# Altium project CryptUS_Motherboard_Rev1_A.PrjPcb
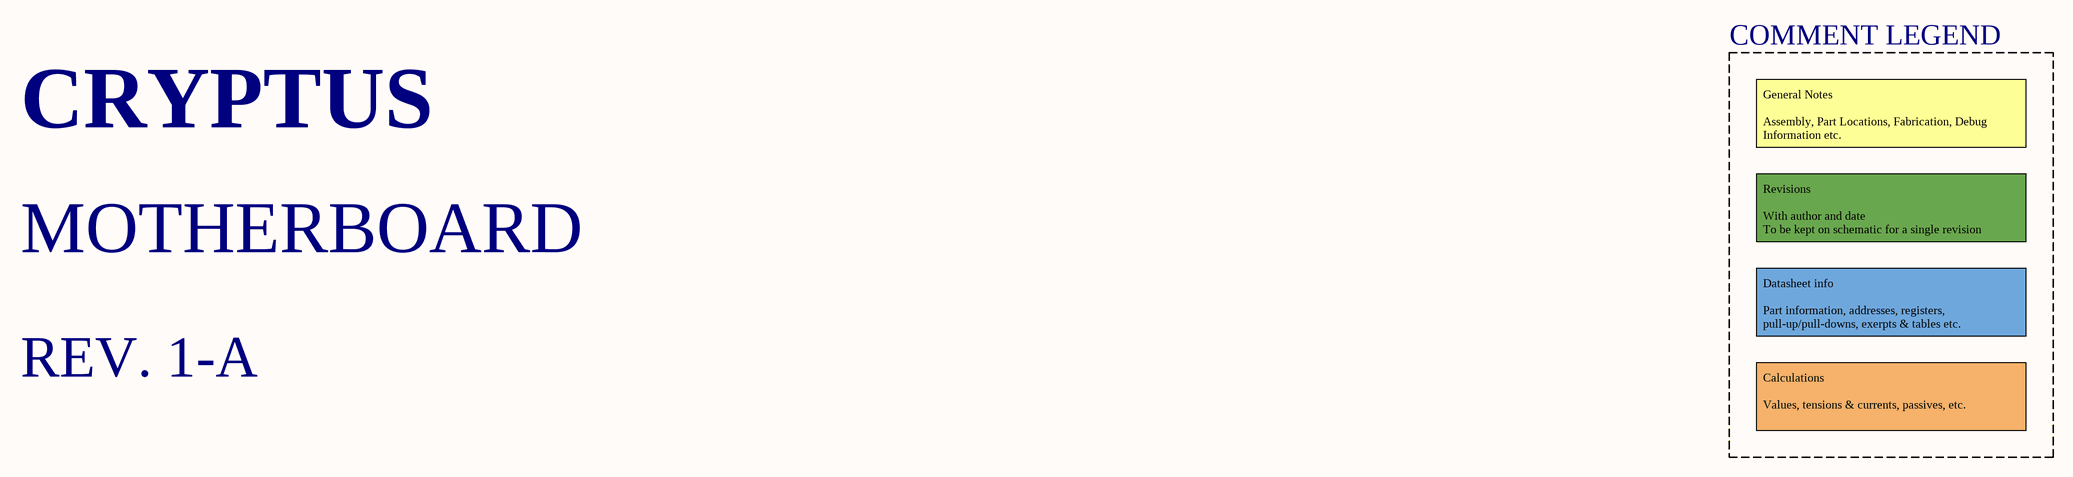
[diagram p0: Title.SchDoc]
Project: CryptUS_Motherboard
6 sheets, 42 parts. Net scope: global (net labels, ports and power ports of the same name join across sheets).
Board file: Motherboard_Rev1_A.PcbDoc
Sheets:
  Title.SchDoc
  Mechanical and Interconnect.SchDoc
  Power.SchDoc
  IO Extender.SchDoc
  Telemetry.SchDoc
  Debug.SchDoc

## Sheet Title.SchDoc
size 420 x 297 mm; SheetNumber: 1; SheetTotal: 3

### Notes on the sheet
- COMMENT LEGEND
- CRYPTUS
- General Notes
  Assembly, Part Locations, Fabrication, Debug Information etc.
- MOTHERBOARD
- Revisions
  With author and date
  To be kept on schematic for a single revision
- Datasheet info
  Part information, addresses, registers, pull-up/pull-downs, exerpts & tables etc.
- REV. 1-A
- Calculations
  Values, tensions & currents, passives, etc.
- PROJECT
- TITLE
- FILE NAME
- A3
- SIZE
- DWG NO.
- SHEET
- OF
- REV

## Sheet Mechanical and Interconnect.SchDoc: Mechanical and Interconnect
size 420 x 297 mm; Address1: CryptUS; Address3: Pascal-Emmanuel Lachance; Address4: Benjamin Gélinas; Revision: A; SheetNumber: 2; SheetTotal: 7
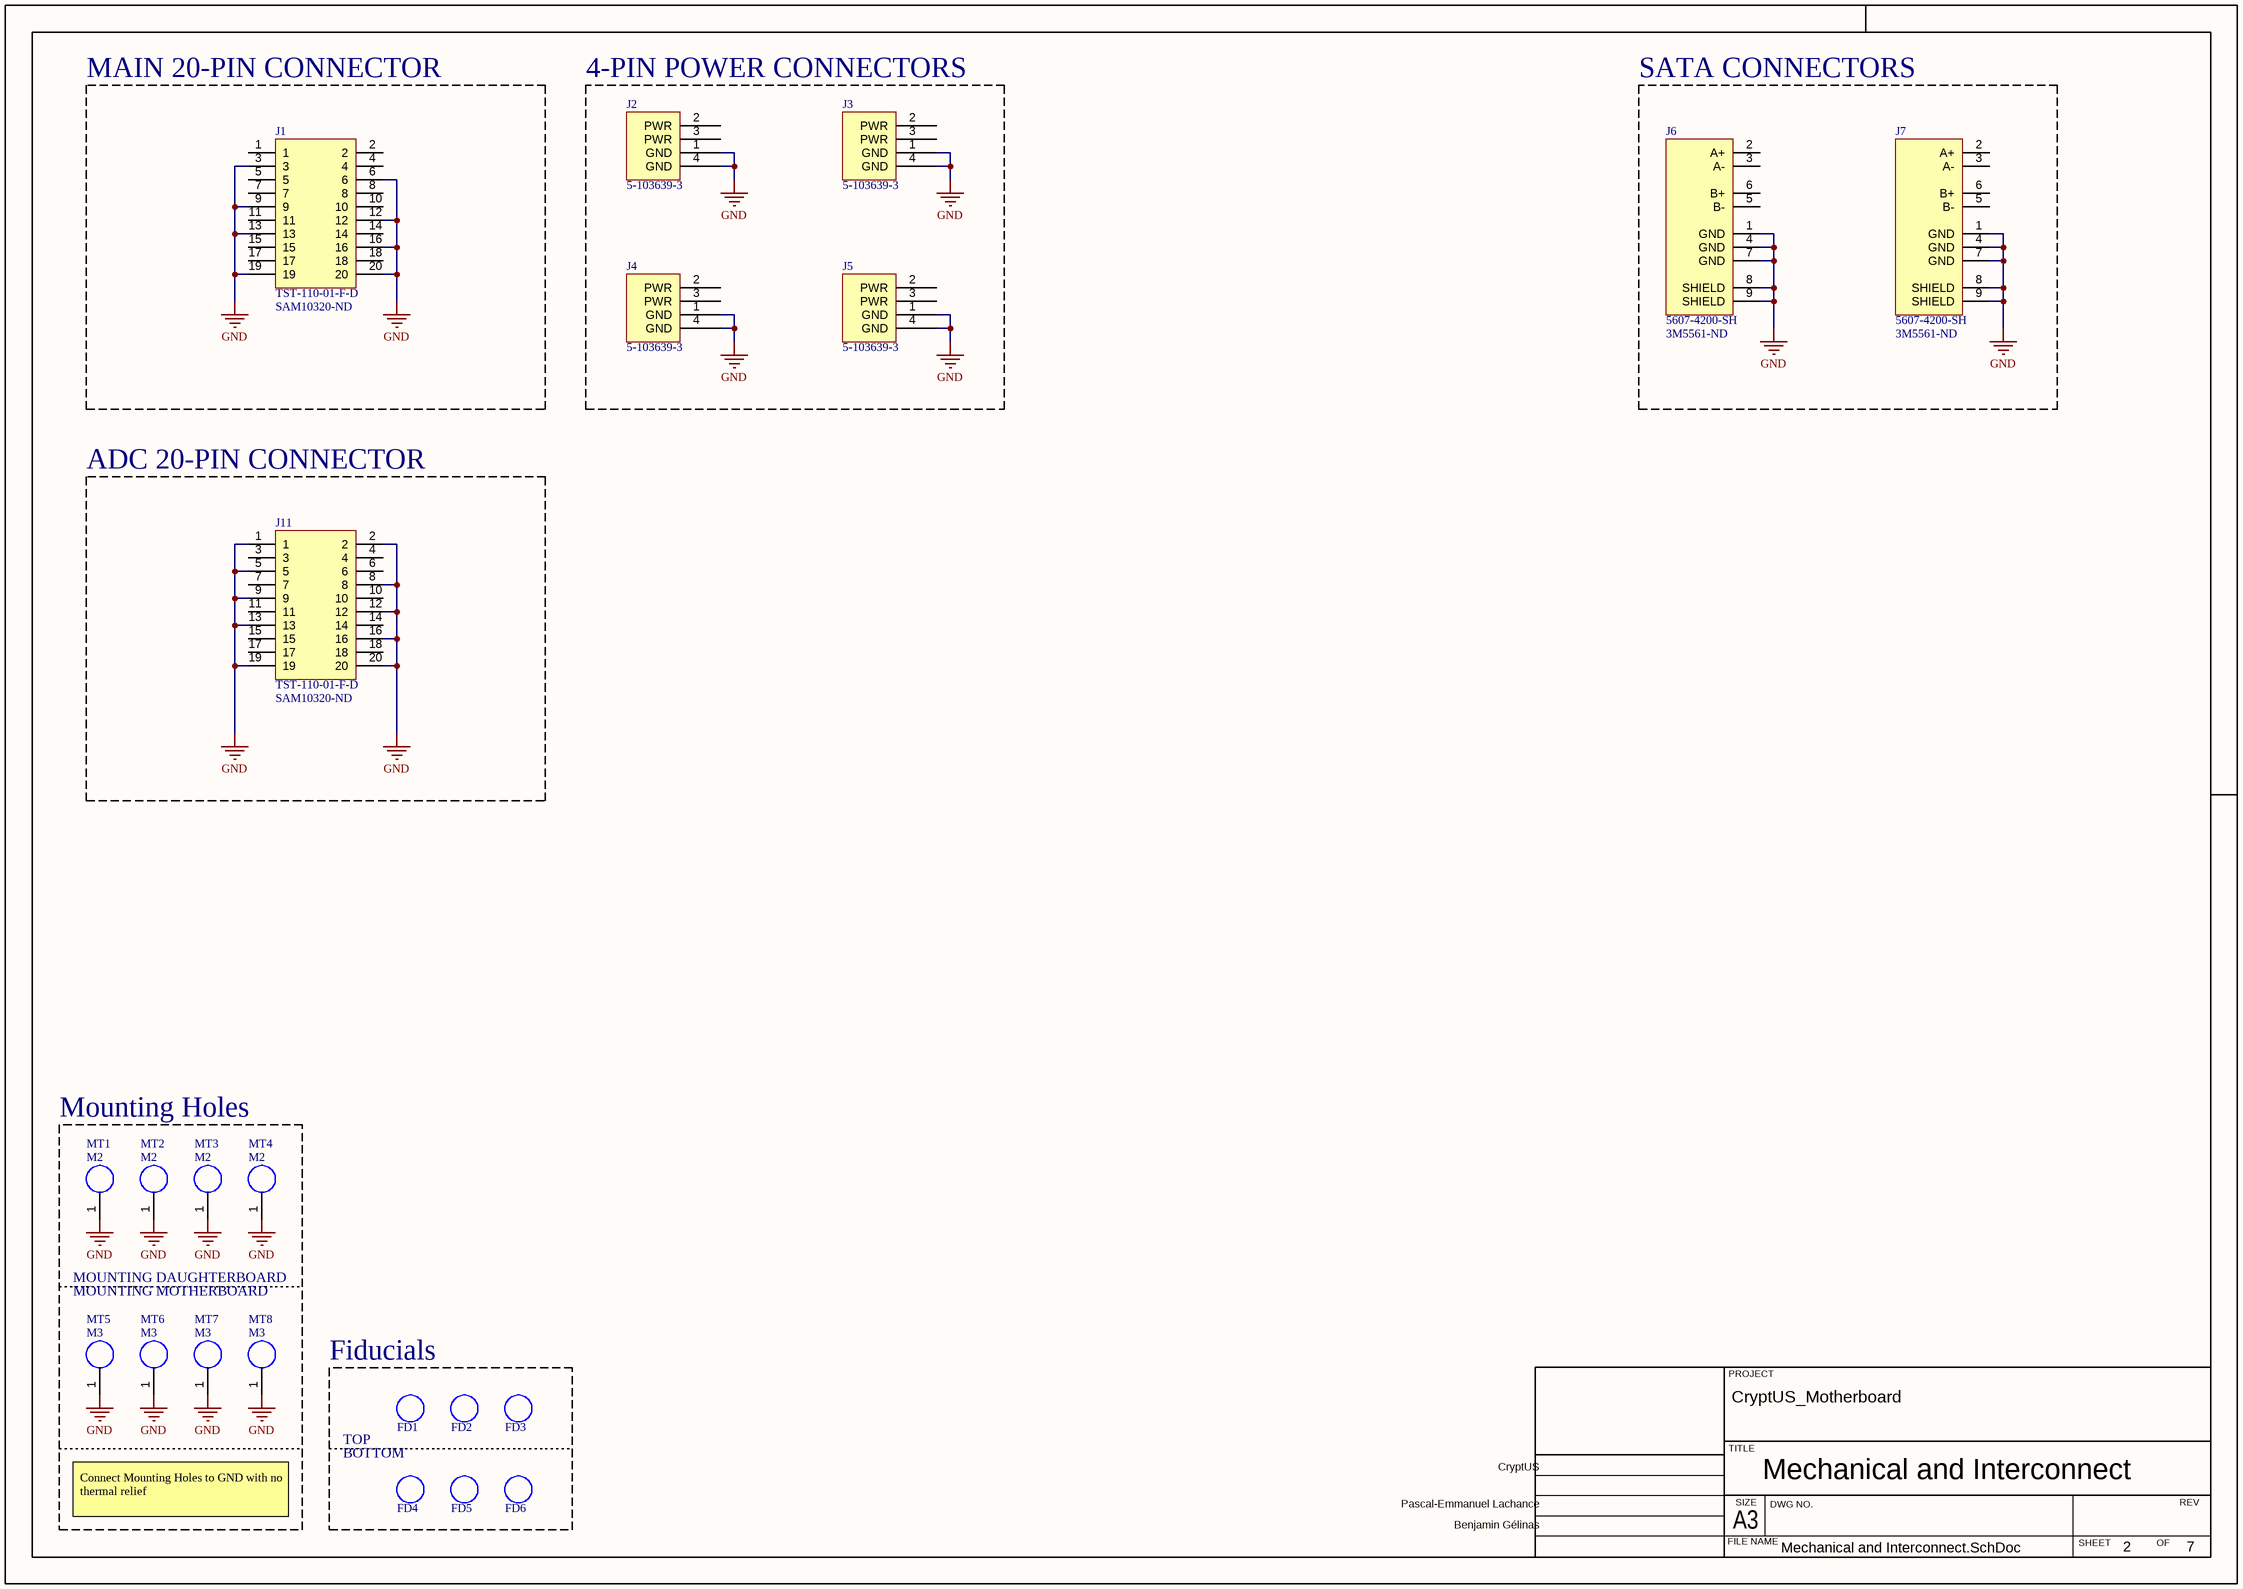
[diagram p1: Mechanical and Interconnect.SchDoc]

### Parts
FD1  FIDUCIAL  [FIDUCIAL]  (value not drawn)
FD2  FIDUCIAL  [FIDUCIAL]  (value not drawn)
FD3  FIDUCIAL  [FIDUCIAL]  (value not drawn)
FD4  FIDUCIAL  [FIDUCIAL]  (value not drawn)
FD5  FIDUCIAL  [FIDUCIAL]  (value not drawn)
FD6  FIDUCIAL  [FIDUCIAL]  (value not drawn)
J1  TST-110-01-F-D  Supplier Part Number 1: SAM10320-ND  [TST-110-01-F-D]
J2  5-103639-3  [5-103639-3]
J3  5-103639-3  [5-103639-3]
J4  5-103639-3  [5-103639-3]
J5  5-103639-3  [5-103639-3]
J6  5607-4200-SH  Supplier Part Number 1: 3M5561-ND  [5607-4200-SH]
J7  5607-4200-SH  Supplier Part Number 1: 3M5561-ND  [5607-4200-SH]
J11  TST-110-01-F-D  Supplier Part Number 1: SAM10320-ND  [TST-110-01-F-D]
MT1  M2  [MTH_M2]
MT2  M2  [MTH_M2]
MT3  M2  [MTH_M2]
MT4  M2  [MTH_M2]
MT5  M3  [MTH_M3]
MT6  M3  [MTH_M3]
MT7  M3  [MTH_M3]
MT8  M3  [MTH_M3]

### Blocks framed on the sheet
MAIN 20-PIN CONNECTOR: J1
4-PIN POWER CONNECTORS: J2-J5
SATA CONNECTORS: J6 J7
ADC 20-PIN CONNECTOR: J11
Mounting Holes: MT1-MT8
Fiducials: FD1-FD6

### Nets
GND: J1.3 J1.6 J1.9 J1.12 J1.13 J1.16 J1.19 J1.20 J2.1(GND) J2.4(GND) J3.1(GND) J3.4(GND) J4.1(GND) J4.4(GND) J5.1(GND) J5.4(GND) J6.1(GND) J6.4(GND) J6.7(GND) J6.8(SHIELD) J6.9(SHIELD) J7.1(GND) J7.4(GND) J7.7(GND) J7.8(SHIELD) J7.9(SHIELD) J11.1 J11.2 J11.5 J11.8 J11.9 J11.12 J11.13 J11.16 J11.19 J11.20 MT1.1 MT2.1 MT3.1 MT4.1 MT5.1 MT6.1 MT7.1 MT8.1

Not connected (* = marked no-connect by the designer): J1 1 2 4 5 7 8 10 11 14 15 17 18; J2 2(PWR) 3(PWR); J3 2(PWR) 3(PWR); J4 2(PWR) 3(PWR); J5 2(PWR) 3(PWR); J6 2(A+) 3(A-) 5(B-) 6(B+); J7 2(A+) 3(A-) 5(B-) 6(B+); J11 3 4 6 7 10 11 14 15 17 18

### Notes on the sheet
- MOUNTING MOTHERBOARD
- MOUNTING DAUGHTERBOARD
- (near FD4) BOTTOM
- TOP
- Connect Mounting Holes to GND with no thermal relief
- PROJECT
- TITLE
- FILE NAME
- A3
- SIZE
- DWG NO.
- SHEET
- OF
- REV

### Library data of the parts
J1 J11 = CONN_TST-100-01-F-D: CONN HEADER VERT 20POS 2.54MM; Mfr: Samtech Inc.; Number of positions: 20; Pitch: 100mils; Contact Length: 250mils; Current Rating: 3.4A per contact; Number of rows: 2; Mounting Type: Through Hole; Operating Temperature: -55C - 125C; Supplier 1: Digi-Key
J2-J5 = CONN_5-103639-3: CONN HEADER VERT 4POS 2.54MM; Mfr: TE Connectivity; Number of positions: 4; Pitch: 100mil; Contact Length: 230mil; Current: 5.2A / contact; Operating Temperature: -65C - 105C
J6 J7 = CONN_5607-4200-SH: 7 Position SATA Plug Connector Solder Surface Mount, Right Angle; Mfr: 3M; Supplier 1: Digi-Key
MT1-MT8 = MOUNTING_HOLE

## Sheet Power.SchDoc
size 420 x 297 mm; SheetNumber: 3; SheetTotal: 3
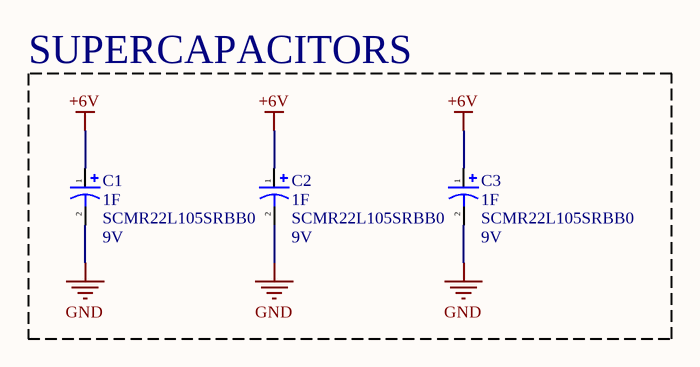
[diagram p2: Power.SchDoc]

### Parts
C1  1F  Rated Voltage: 9V  [SCMR22L105SRBB0]
C2  1F  Rated Voltage: 9V  [SCMR22L105SRBB0]
C3  1F  Rated Voltage: 9V  [SCMR22L105SRBB0]

### Blocks framed on the sheet
SUPERCAPACITORS: C1-C3

### Nets
+6V: C1.1 C2.1 C3.1
GND: C1.2 C2.2 C3.2

### Notes on the sheet
- PROJECT
- TITLE
- FILE NAME
- A3
- SIZE
- DWG NO.
- SHEET
- OF
- REV

### Library data of the parts
C1-C3 = CAP_SCMR22L105SRBB0: CAP 1F -10% +30% 9V T/H; Mfr: AVX Corporation; Tolerance: -10% +30%; Operating Temperature: -40C - 65C; ComponentLink1Description: Digikey; ComponentLink1URL: https://www.digikey.ca/en/products/detail/avx-corporation/SCMR22L105SRBB0/7595432; ComponentLink2Description: Mouser; ComponentLink2URL: https://www.mouser.ca/ProductDetail/AVX/SCMR22L105SRBB0; Digikey Part Number: 478-11316-ND; Manufacturer Part Number: SCMR22L105SRBB0

## Sheet IO Extender.SchDoc
size 420 x 297 mm; SheetNumber: 4; SheetTotal: 7
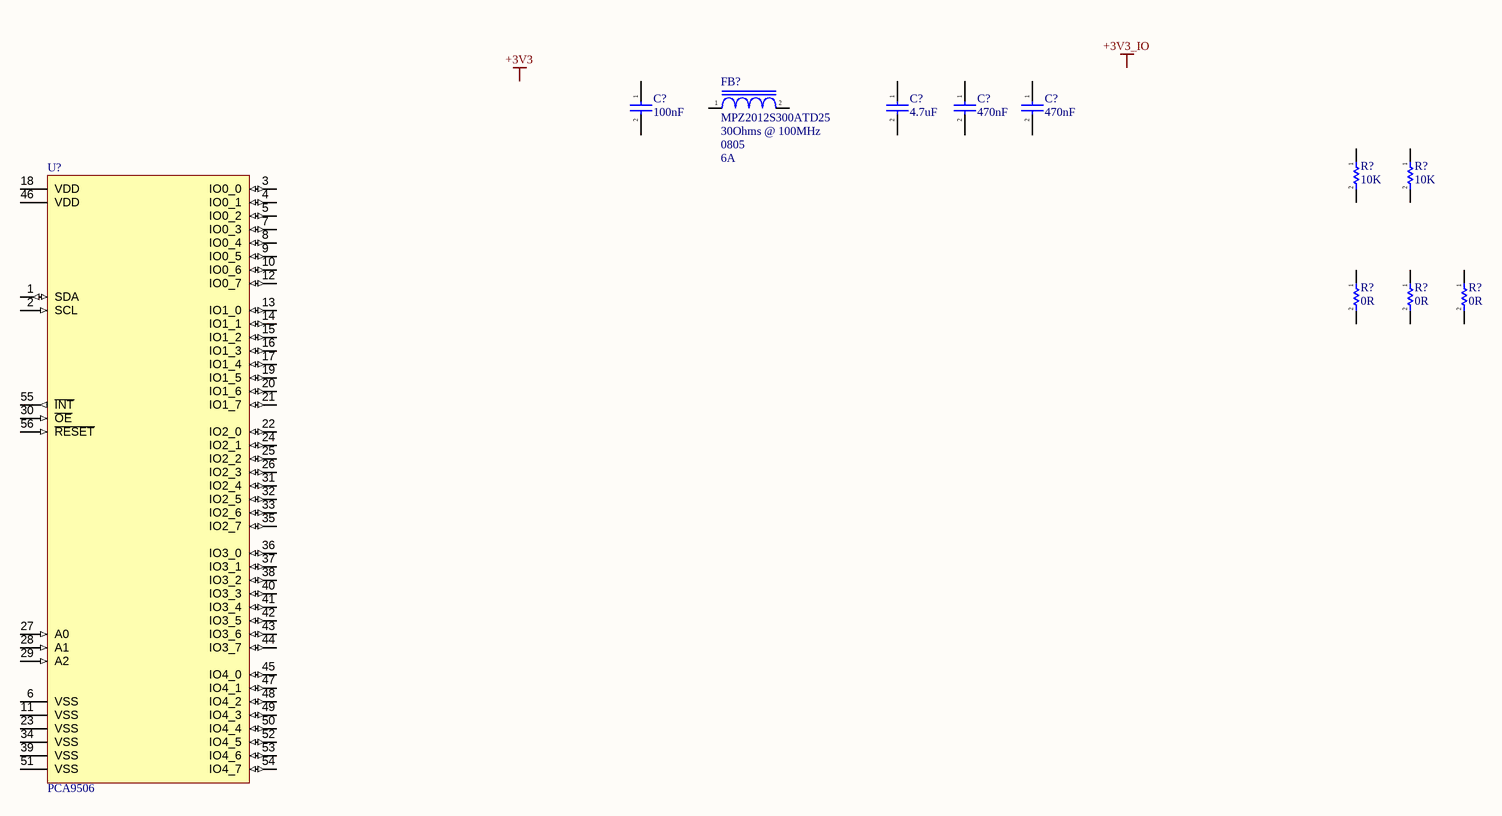
[diagram p3: IO Extender.SchDoc]

### Parts
(Parts that share a designator on the sheet are numbered #1, #2 ... from top to bottom, then left to right.)
C?#1  100nF  [CAP_0402]
C?#2  4.7uF  [CAP_0805]
C?#3  470nF  [CAP_0402]
C?#4  470nF  [CAP_0402]
FB?#1  MPZ2012S300ATD25  Impedance @ Freq: 30Ohms @ 100MHz  Package / Case: 0805  Current Rating: 6A  [IND_0805]
R?#1  10K  [RES_0603]
R?#2  10K  [RES_0603]
R?#3  0R  [RES_0603]
R?#4  0R  [RES_0603]
R?#5  0R  [RES_0603]
U?#1  PCA9506  [PCA9506]

### Nets

Not connected (* = marked no-connect by the designer): C?#1 1 2; C?#2 1 2; C?#3 1 2; C?#4 1 2; FB?#1 1 2; R?#1 1 2; R?#2 1 2; R?#3 1 2; R?#4 1 2; R?#5 1 2; U?#1 1(SDA) 2(SCL) 3(IO0_0) 4(IO0_1) 5(IO0_2) 6(VSS) 7(IO0_3) 8(IO0_4) 9(IO0_5) 10(IO0_6) 11(VSS) 12(IO0_7) 13(IO1_0) 14(IO1_1) 15(IO1_2) 16(IO1_3) 17(IO1_4) 18(VDD) 19(IO1_5) 20(IO1_6) 21(IO1_7) 22(IO2_0) 23(VSS) 24(IO2_1) 25(IO2_2) 26(IO2_3) 27(A0) 28(A1) 29(A2) 30(~{OE}) 31(IO2_4) 32(IO2_5) 33(IO2_6) 34(VSS) 35(IO2_7) 36(IO3_0) 37(IO3_1) 38(IO3_2) 39(VSS) 40(IO3_3) 41(IO3_4) 42(IO3_5) 43(IO3_6) 44(IO3_7) 45(IO4_0) 46(VDD) 47(IO4_1) 48(IO4_2) 49(IO4_3) 50(IO4_4) 51(VSS) 52(IO4_5) 53(IO4_6) 54(IO4_7) 55(~{INT}) 56(~{RESET})

### Notes on the sheet
- Labels drawn without touching a wire or pin: +3V3, +3V3_IO
- PROJECT
- TITLE
- FILE NAME
- A3
- SIZE
- DWG NO.
- SHEET
- OF
- REV

### Library data of the parts
C?#1-C?#4 = CAP_CER: Generic SMT Ceramic Capacitor; Voltage - Rated: 25V; Operating Temperature: *; Tolerance: *; Mfr: *; ComponentLink1Description: Digikey; ComponentLink1URL: [Digikey Link]; Digikey Part No: *; ComponentLink2Description: Datasheet; ComponentLink2URL: [Datasheet Link]
  C?#1 C?#3 C?#4: Footprint: 0402
  C?#2: Footprint: 0805
FB?#1 = IND_MPZ2012S300ATD25: 30 Ohms @ 100 MHz 1 Power Line Ferrite Bead 0805 (2012 Metric) 6A 10mOhm; Resistance: 10mOhms; Operating Temperature: -55C - 125C; Rating: AEC-Q200
R?#1 R?#2 = RESISTOR: Power: 1/16W; Tolerance: 10%; Automotive: *; Operating Temperature: *; # Digikey: *; ComponentLink1Description: Digikey; ComponentLink1URL: *; # Manufacturer: *; Package / Case: 0603
R?#3-R?#5 = RESISTOR: Power: 1/8W; Tolerance: 10%; Automotive: *; Operating Temperature: *; Package / Case: 0603; # Digikey: *; ComponentLink1Description: Digikey; ComponentLink1URL: *; # Manufacturer: *
U?#1 = IC_PCA9506: I/O Expander 40 pins I2C TSSOP-56; Mfr: NXP; Number of I/O: 40; Output Type: Push-Pull; Current Source: 10mA; Current Sink: 25mA; Clock: 400kHz; Voltage Supply: 2.3V - 5.5V; Operating Temperature: -40C to 85C; Supplier 1: Digi-Key; Supplier Part Number 1: 568-11940-1-ND; ComponentLink1Description: Digikey; ComponentLink1URL: https://www.digikey.ca/en/products/detail/nxp-usa-inc/PCA9506DGG-518/1157017; ComponentLink2Description: Datasheet; ComponentLink2URL: https://www.nxp.com/docs/en/data-sheet/PCA9505_9506.pdf

## Sheet Telemetry.SchDoc
size 420 x 297 mm; SheetNumber: 5; SheetTotal: 7
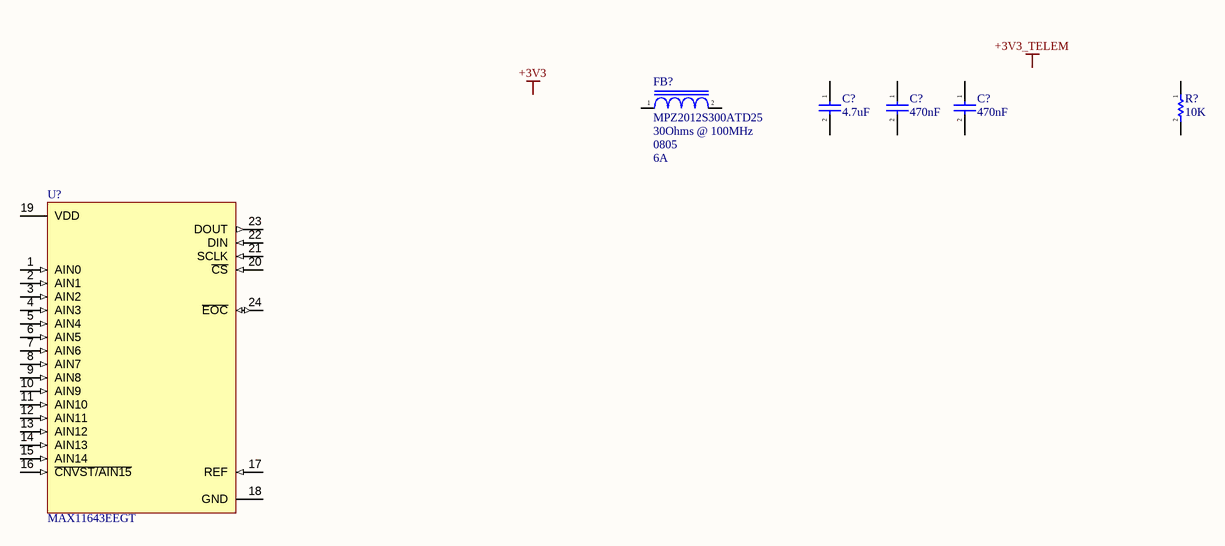
[diagram p4: Telemetry.SchDoc]

### Parts
(Parts that share a designator on the sheet are numbered #1, #2 ... from top to bottom, then left to right.)
C?#5  4.7uF  [CAP_0805]
C?#6  470nF  [CAP_0402]
C?#7  470nF  [CAP_0402]
FB?#2  MPZ2012S300ATD25  Impedance @ Freq: 30Ohms @ 100MHz  Package / Case: 0805  Current Rating: 6A  [IND_0805]
R?#6  10K  [RES_0603]
U?#2  MAX11643EEGT  [MAX11643EEG+]

### Nets

Not connected (* = marked no-connect by the designer): C?#5 1 2; C?#6 1 2; C?#7 1 2; FB?#2 1 2; R?#6 1 2; U?#2 1(AIN0) 2(AIN1) 3(AIN2) 4(AIN3) 5(AIN4) 6(AIN5) 7(AIN6) 8(AIN7) 9(AIN8) 10(AIN9) 11(AIN10) 12(AIN11) 13(AIN12) 14(AIN13) 15(AIN14) 16(~{CNVST/AIN15}) 17(REF) 18(GND) 19(VDD) 20(~{CS}) 21(SCLK) 22(DIN) 23(DOUT) 24(~{EOC})

### Notes on the sheet
- Labels drawn without touching a wire or pin: +3V3, +3V3_TELEM
- PROJECT
- TITLE
- FILE NAME
- A3
- SIZE
- DWG NO.
- SHEET
- OF
- REV

### Library data of the parts
C?#5-C?#7 = CAP_CER: as C?#1 on sheet IO Extender; Operating Temperature: *; Tolerance: *; Mfr: *; ComponentLink1Description: Digikey; ComponentLink1URL: [Digikey Link]; Digikey Part No: *; ComponentLink2Description: Datasheet; ComponentLink2URL: [Datasheet Link]
  C?#5: Footprint: 0805
  C?#6 C?#7: Footprint: 0402
FB?#2 = IND_MPZ2012S300ATD25: as FB?#1 on sheet IO Extender; Operating Temperature: -55C - 125C; Rating: AEC-Q200
R?#6 = RESISTOR: Power: 1/16W; Tolerance: 10%; Automotive: *; Operating Temperature: *; # Digikey: *; ComponentLink1Description: Digikey; ComponentLink1URL: *; # Manufacturer: *; Package / Case: 0603
U?#2 = IC_MAX11643EEGT: 8 Bit Analog to Digital Converter 16 Input 1 SAR 24-QSOP; Mfr: Maxim Integrated; Number of Bits: 8; Sampling rate: 300k; Number of inputs: 16; Input Type: Single Ended; Internal Reference: 2.5V; Internal Clock: 4.4MHz; Voltage Supply: 2.7V - 3.6V; Operating Temperature: -40C to 85C; Supplier 1: Mouser; Supplier Part Number 1: 700-MAX11643EEG+; ComponentLink1Description: Digikey; ComponentLink1URL: https://www.digikey.ca/en/products/detail/analog-devices-inc-maxim-integrated/MAX11643EEG/2793247; ComponentLink2Description: Datasheet; ComponentLink2URL: https://datasheets.maximintegrated.com/en/ds/MAX11638-MAX11643.pdf

## Sheet Debug.SchDoc
size 420 x 297 mm; SheetNumber: 4; SheetTotal: 4

### Notes on the sheet
- PROJECT
- TITLE
- FILE NAME
- A3
- SIZE
- DWG NO.
- SHEET
- OF
- REV

## Nets that join several sheets
GND: Mechanical and Interconnect (44 pins), Power (C1.2 C2.2 C3.2)